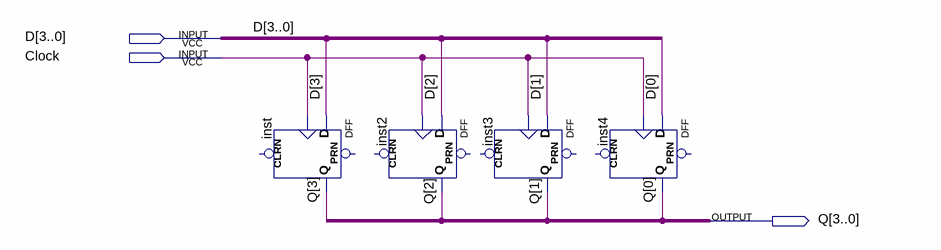
[diagram p0: schematic sheet]
// Quartus schematic THANHGHI4BIT.bdf as structural Verilog: 4 symbols, 3 pins
module THANHGHI4BIT (
  input  [3:0] D,
  input  Clock,
  output [3:0] Q
);

  DFF inst (.CLK(Clock), .D(D[3]), .Q(Q[3]));  // open: CLRN, PRN
  DFF inst2 (.CLK(Clock), .D(D[2]), .Q(Q[2]));  // open: CLRN, PRN
  DFF inst3 (.CLK(Clock), .D(D[1]), .Q(Q[1]));  // open: CLRN, PRN
  DFF inst4 (.CLK(Clock), .D(D[0]), .Q(Q[0]));  // open: CLRN, PRN
endmodule
